# EAGLE design prius-gen2-v1.0 (EAGLE 6.4)
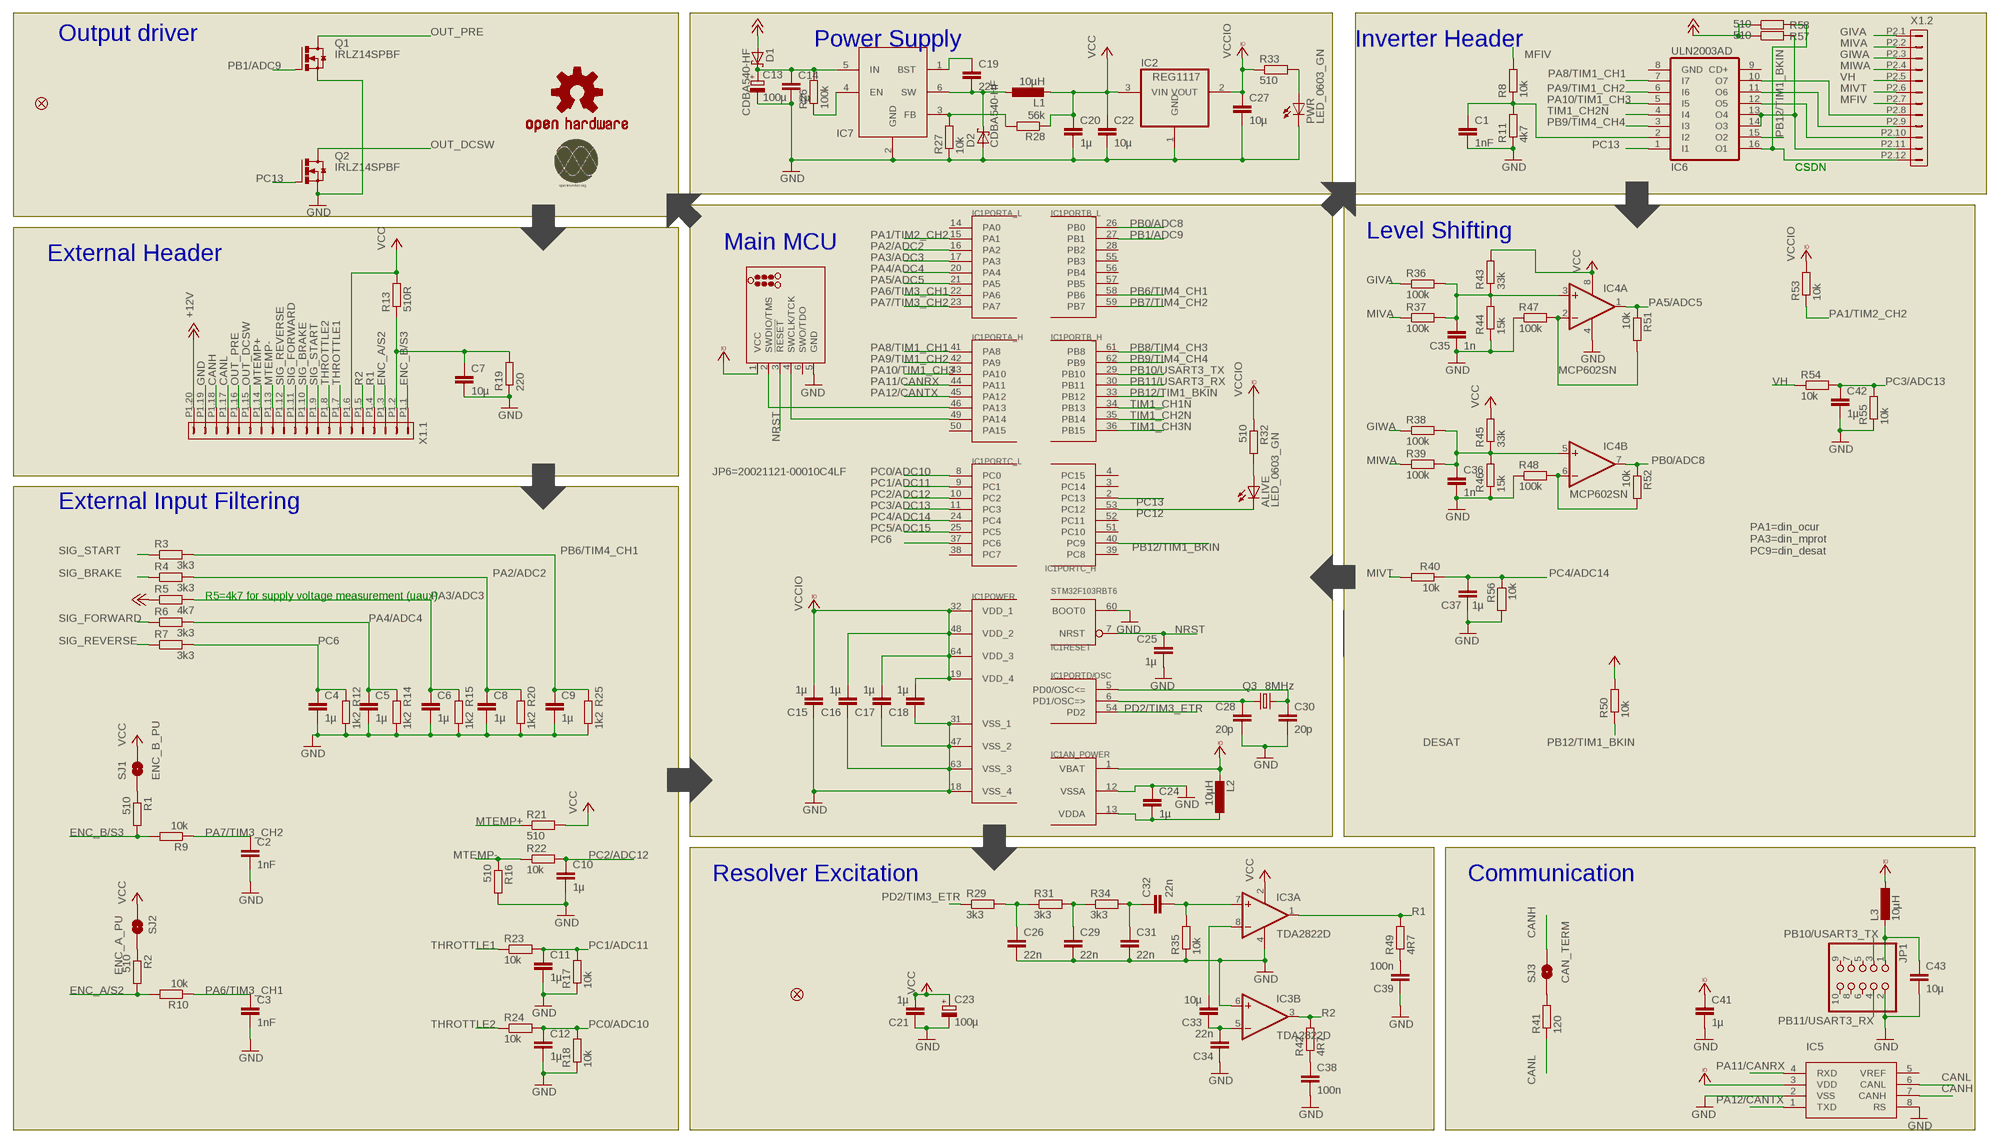
[diagram p0: schematic, sheet 1]

## Parts
ALIVE  LED_0603_GN  LEDSML0805  [SML0805]
C1  1nF  C-EUC0603  [C0603]
C2  1nF  C-EUC0603  [C0603]
C3  1nF  C-EUC0603  [C0603]
C4  1µ  C-EUC0603  [C0603]
C5  1µ  C-EUC0603  [C0603]
C6  1µ  C-EUC0603  [C0603]
C7  10µ  C-EUC0805  [C0805]
C8  1µ  C-EUC0603  [C0603]
C9  1µ  C-EUC0603  [C0603]
C10  1µ  C-EUC0603  [C0603]
C11  1µ  C-EUC0603  [C0603]
C12  1µ  C-EUC0603  [C0603]
C13  100µ  CPOL-EUUD-6,3X7,7  [UD-6,3X7,7_NICHICON]
C14  1µ  C-EUC0603  [C0603]
C15  1µ  C-EUC0603  [C0603]
C16  1µ  C-EUC0603  [C0603]
C17  1µ  C-EUC0603  [C0603]
C18  1µ  C-EUC0603  [C0603]
C19  22n  C-EUC0603  [C0603]
C20  1µ  C-EUC0603  [C0603]
C21  1µ  C-EUC0603  [C0603]
C22  10µ  C-EUC0805  [C0805]
C23  100µ  CPOL-EUUD-6,3X7,7  [UD-6,3X7,7_NICHICON]
C24  1µ  C-EUC0603  [C0603]
C25  1µ  C-EUC0603  [C0603]
C26  22n  C-EUC0603  [C0603]
C27  10µ  C-EUC0805  [C0805]
C28  20p  C-EUC0603  [C0603]
C29  22n  C-EUC0603  [C0603]
C30  20p  C-EUC0603  [C0603]
C31  22n  C-EUC0603  [C0603]
C32  22n  C-EUC0603  [C0603]
C33  10µ  C-EUC0805  [C0805]
C34  22n  C-EUC0603  [C0603]
C35  1n  C-EUC0603  [C0603]
C36  1n  C-EUC0603  [C0603]
C37  1µ  C-EUC0603  [C0603]
C38  100n  C-EUC0603  [C0603]
C39  100n  C-EUC0603  [C0603]
C41  1µ  C-EUC0603  [C0603]
C42  1µ  C-EUC0603  [C0603]
C43  10µ  C-EUC0805  [C0805]
D1  CDBA540-HF  SCHOTTKY-DIODESMD  [SMB]
D2  CDBA540-HF  SCHOTTKY-DIODESMD  [SMB]
FID1  FIDUCIAL1X2.5  [FIDUCIAL-1X2.5]
FID2  FIDUCIAL1X2.5  [FIDUCIAL-1X2.5]
IC1  STM32F103RBT6  STM32F10XRXT6  [TQFP64]
IC2  REG1117  [SOT223]
IC3  TDA2822D  [SO08]
IC4  MCP602SN  [SO08]
IC5  SN65HVD230  MCP2551  [SO08]
IC6  ULN2003AD  [SO16]
IC7  MB2359DJ  [SOT23-6]
J1  TC2030_SWD-MCP  [TC2030-MCP]
JP1  PINHD-2X5/90  [2X05/90]
L1  10µH  L-EUL2825P  [L2825P]
L2  10µH  L-EUL2012C  [L2012C]
L3  10µH  L-EUL2012C  [L2012C]
LOGO1  OSHW-LOGOM  [OSHW-LOGO-M]
PWR  LED_0603_GN  LEDSML0805  [SML0805]
Q1  IRLZ14SPBF  AP9T18GH-HF  [D-PAK_TO252AA]
Q2  IRLZ14SPBF  AP9T18GH-HF  [D-PAK_TO252AA]
Q3  8MHz  CRYSTALTXC-7A  [CRYSTAL-TXC-7A]
R1  510  R-EU_R0603  [R0603]
R2  510  R-EU_R0603  [R0603]
R3  3k3  R-EU_R0603  [R0603]
R4  3k3  R-EU_R0603  [R0603]
R5  4k7  R-EU_R0603  [R0603]
R6  3k3  R-EU_R0603  [R0603]
R7  3k3  R-EU_R0603  [R0603]
R8  10k  R-EU_R0603  [R0603]
R9  10k  R-EU_R0603  [R0603]
R10  10k  R-EU_R0603  [R0603]
R11  4k7  R-EU_R0603  [R0603]
R12  1k2  R-EU_R0603  [R0603]
R13  510R  R-EU_R0603  [R0603]
R14  1k2  R-EU_R0603  [R0603]
R15  1k2  R-EU_R0603  [R0603]
R16  510  R-EU_R0603  [R0603]
R17  10k  R-EU_R0603  [R0603]
R18  10k  R-EU_R0603  [R0603]
R19  220  R-EU_R0603  [R0603]
R20  1k2  R-EU_R0603  [R0603]
R21  510  R-EU_R0603  [R0603]
R22  10k  R-EU_R0603  [R0603]
R23  10k  R-EU_R0603  [R0603]
R24  10k  R-EU_R0603  [R0603]
R25  1k2  R-EU_R0603  [R0603]
R26  100k  R-EU_R0603  [R0603]
R27  10k  R-EU_R0603  [R0603]
R28  56k  R-EU_R0603  [R0603]
R29  3k3  R-EU_R0603  [R0603]
R31  3k3  R-EU_R0603  [R0603]
R32  510  R-EU_R0603  [R0603]
R33  510  R-EU_R0603  [R0603]
R34  3k3  R-EU_R0603  [R0603]
R35  10k  R-EU_R0603  [R0603]
R36  100k  R-EU_R0603  [R0603]
R37  100k  R-EU_R0603  [R0603]
R38  100k  R-EU_R0603  [R0603]
R39  100k  R-EU_R0603  [R0603]
R40  10k  R-EU_R0603  [R0603]
R41  120  R-EU_R0603  [R0603]
R42  4R7  R-EU_R0603  [R0603]
R43  33k  R-EU_R0603  [R0603]
R44  15k  R-EU_R0603  [R0603]
R45  33k  R-EU_R0603  [R0603]
R46  15k  R-EU_R0603  [R0603]
R47  100k  R-EU_R0603  [R0603]
R48  100k  R-EU_R0603  [R0603]
R49  4R7  R-EU_R0603  [R0603]
R50  10k  R-EU_R0603  [R0603]
R51  10k  R-EU_R0603  [R0603]
R52  10k  R-EU_R0603  [R0603]
R53  10k  R-EU_R0603  [R0603]
R54  10k  R-EU_R0603  [R0603]
R55  10k  R-EU_R0603  [R0603]
R56  10k  R-EU_R0603  [R0603]
R57  510  R-EU_R0603  [R0603]
R58  510  R-EU_R0603  [R0603]
SJ1  ENC_B_PU  SOLDERJUMPERNO  [SJ_2S-NO]
SJ2  ENC_A_PU  SOLDERJUMPERNO  [SJ_2S-NO]
SJ3  CAN_TERM  SOLDERJUMPERNO  [SJ_2S-NO]
U$1  OI-LOGO  [OI_LOGO]
X1  5810132011  [5810132011]

## Nets
+12V: D1.A R5.1 R57.1 R58.1 X1.P1.20
CANH: IC5.7(CANH) SJ3.2 X1.P1.18
CANL: IC5.6(CANL) R41.1 X1.P1.17
ENC_A/S2: R2.2 R10.2 X1.P1.3
ENC_B/S3: R1.2 R9.2 X1.P1.1
GIVA: R36.1 X1.P2.1
GIWA: R38.1 X1.P2.3
GND: C1.2 C2.2 C3.2 C4.2 C5.2 C6.2 C7.2 C8.2 C9.2 C10.2 C11.2 C12.2 C13.- C14.2 C15.1 C16.1 C17.1 C18.1 C20.2 C21.1 C22.2 C23.- C24.1 C25.2 C26.2 C27.2 C28.2 C29.2 C30.2 C31.2 C34.1 C35.2 C36.2 C37.2 C38.2 C39.1 C41.2 C42.2 C43.2 D2.A IC1.12(AN_POWER:VSSA) IC1.18(POWER:VSS_4) IC1.31(POWER:VSS_1) IC1.47(POWER:VSS_2) IC1.60(RESET:BOOT0) IC1.63(POWER:VSS_3) IC2.1(GND) IC3.4(P:V-) IC3.6(B:+IN) IC4.4(P:V-) IC5.2(VSS) IC5.8(RS) IC7.2(GND) J1.5(GND) JP1.2 PWR.C Q1.3(S) Q2.3(S) R11.1 R12.1 R14.1 R15.1 R16.2 R17.1 R18.1 R19.1 R20.1 R25.1 R27.1 R35.1 R44.1 R46.1 R47.1 R48.1 R55.1 R56.2 X1.P1.19
MFIV: R8.2 X1.P2.7
MIVA: R37.1 X1.P2.2
MIVT: R40.2 X1.P2.6
MIWA: R39.1 X1.P2.4
MTEMP+: R21.1 X1.P1.14
MTEMP-: R16.1 R22.1 X1.P1.13
N$1: IC6.12(O5) X1.P2.10
N$2: C28.1 IC1.6(PORTD/OSC:PD1/OSC=>) Q3.P$1
N$3: C13.+ C14.1 D1.C IC7.5(IN) R26.2
N$4: C30.1 IC1.5(PORTD/OSC:PD0/OSC<=) Q3.P$2
N$5: C19.1 IC7.1(BST)
N$6: IC1.46(PORTA_H:PA13) J1.2(SWDIO/TMS)
N$7: C24.2 IC1.13(AN_POWER:VDDA) L2.1
N$8: IC7.4(EN) R26.1
N$9: IC1.49(PORTA_H:PA14) J1.4(SWCLK/TCK)
N$10: C33.1 C34.2 IC3.5(B:-IN)
N$11: C39.2 R49.1
N$12: C33.2 IC3.8(A:-IN)
N$13: IC7.3(FB) R27.2 R28.2
N$14: C19.2 D2.C IC7.6(SW) L1.1
N$15: IC6.11(O6) X1.P2.9
N$16: IC6.10(O7) X1.P2.8
N$17: C29.1 R31.2 R34.1
N$18: C31.1 C32.1 R34.2
N$19: C32.2 IC3.7(A:+IN) R35.2
N$20: R2.1 SJ2.2
N$21: R1.1 SJ1.1
N$22: PWR.A R33.2
N$23: ALIVE.A R32.2
N$24: C1.1 IC6.2(I2) R8.1 R11.2
N$25: IC6.16(O1) R58.2 X1.P2.12
N$26: R41.2 SJ3.1
N$27: C38.1 R42.1
N$28: C43.1 JP1.1 L3.2
N$29: IC6.13(O4) IC6.14(O3) R57.2 X1.P2.11
N$30: C26.1 R29.2 R31.1
N$33: C36.1 IC4.5(B:+IN) R38.2 R39.2 R45.1 R46.2
N$34: C35.1 IC4.3(A:+IN) R36.2 R37.2 R43.1 R44.2
N$36: IC4.2(A:-IN) R47.2 R51.2
N$37: IC4.6(B:-IN) R48.2 R52.2
NRST: C25.1 IC1.7(RESET:NRST) J1.3(!RESET)
OUT_DCSW: Q2.4(D) X1.P1.15
OUT_PRE: Q1.4(D) X1.P1.16
PA1/TIM2_CH2: IC1.15(PORTA_L:PA1) R53.1
PA2/ADC2: C8.1 IC1.16(PORTA_L:PA2) R4.2 R20.2
PA3/ADC3: C6.1 IC1.17(PORTA_L:PA3) R5.2 R15.2
PA4/ADC4: C5.1 IC1.20(PORTA_L:PA4) R6.2 R14.2
PA5/ADC5: IC1.21(PORTA_L:PA5) IC4.1(A:OUT) R51.1
PA6/TIM3_CH1: C3.1 IC1.22(PORTA_L:PA6) R10.1
PA7/TIM3_CH2: C2.1 IC1.23(PORTA_L:PA7) R9.1
PA8/TIM1_CH1: IC1.41(PORTA_H:PA8) IC6.7(I7)
PA9/TIM1_CH2: IC1.42(PORTA_H:PA9) IC6.6(I6)
PA10/TIM1_CH3: IC1.43(PORTA_H:PA10) IC6.5(I5)
PA11/CANRX: IC1.44(PORTA_H:PA11) IC5.4(RXD)
PA12/CANTX: IC1.45(PORTA_H:PA12) IC5.1(TXD)
PB0/ADC8: IC1.26(PORTB_L:PB0) IC4.7(B:OUT) R52.1
PB1/ADC9: IC1.27(PORTB_L:PB1) Q1.1(G)
PB6/TIM4_CH1: C9.1 IC1.58(PORTB_L:PB6) R3.2 R25.2
PB7/TIM4_CH2: IC1.59(PORTB_L:PB7)
PB8/TIM4_CH3: IC1.61(PORTB_H:PB8)
PB9/TIM4_CH4: IC1.62(PORTB_H:PB9) IC6.3(I3)
PB10/USART3_TX: IC1.29(PORTB_H:PB10) JP1.3
PB11/USART3_RX: IC1.30(PORTB_H:PB11) JP1.4
PB12/TIM1_BKIN: IC1.33(PORTB_H:PB12) IC1.40(PORTC_H:PC9) IC6.15(O2) R50.1
PC0/ADC10: C12.1 IC1.8(PORTC_L:PC0) R18.2 R24.2
PC1/ADC11: C11.1 IC1.9(PORTC_L:PC1) R17.2 R23.2
PC2/ADC12: C10.1 IC1.10(PORTC_L:PC2) R22.2
PC3/ADC13: C42.1 IC1.11(PORTC_L:PC3) R54.2 R55.2
PC4/ADC14: C37.1 IC1.24(PORTC_L:PC4) R40.1 R56.1
PC5/ADC15: IC1.25(PORTC_L:PC5)
PC6: C4.1 IC1.37(PORTC_L:PC6) R7.2 R12.2
PC12: ALIVE.C IC1.53(PORTC_H:PC12)
PC13: IC1.2(PORTC_H:PC13) IC6.1(I1) Q2.1(G)
PD2/TIM3_ETR: IC1.54(PORTD/OSC:PD2) R29.1
R1: IC3.1(A:OUT) R49.2 X1.P1.4
R2: IC3.3(B:OUT) R42.2 X1.P1.5
S4/S1: C7.1 R13.1 R19.2 X1.P1.2
SIG_BRAKE: R4.1 X1.P1.10
SIG_FORWARD: R6.1 X1.P1.11
SIG_REVERSE: R7.1 X1.P1.12
SIG_START: R3.1 X1.P1.9
THROTTLE1: R23.1 X1.P1.7
THROTTLE2: R24.1 X1.P1.8
TIM1_CH1N: IC1.34(PORTB_H:PB13)
TIM1_CH2N: IC1.35(PORTB_H:PB14) IC6.4(I4)
TIM1_CH3N: IC1.36(PORTB_H:PB15)
VCC: C20.1 C21.2 C22.1 C23.+ IC2.3(VIN) IC3.2(P:V+) IC4.8(P:V+) L1.2 R13.2 R21.2 R28.1 R43.2 R45.2 R50.2 SJ1.2 SJ2.1 X1.P1.6
VCCIO: C15.2 C16.2 C17.2 C18.2 C27.1 C41.1 IC1.1(AN_POWER:VBAT) IC1.19(POWER:VDD_4) IC1.32(POWER:VDD_1) IC1.48(POWER:VDD_2) IC1.64(POWER:VDD_3) IC2.2(VOUT) IC5.3(VDD) J1.1(VCC) L2.2 L3.1 R32.1 R33.1 R53.2
VH: R54.1 X1.P2.5
Unconnected: IC1.3(PORTC_H:PC14) IC1.4(PORTC_H:PC15) IC1.14(PORTA_L:PA0) IC1.28(PORTB_L:PB2) IC1.38(PORTC_L:PC7) IC1.39(PORTC_H:PC8) IC1.50(PORTA_H:PA15) IC1.51(PORTC_H:PC10) IC1.52(PORTC_H:PC11) IC1.55(PORTB_L:PB3) IC1.56(PORTB_L:PB4) IC1.57(PORTB_L:PB5) IC5.5(VREF) IC6.9(CD+) J1.6(SWO/TDO) JP1.5 JP1.6 JP1.7 JP1.8 JP1.9 JP1.10

## Notes on the sheet
- Output driver | Power Supply | Inverter Header
- IC7
- CSDN | CSDN
- Level Shifting
- Main MCU
- External Header
- JP6=20021121-00010C4LF
- External Input Filtering
- PA1=din_ocur
  PA3=din_mprot
  PC9=din_desat
- R5=4k7 for supply voltage measurement (uaux)
- DESAT
- Resolver Excitation | Communication
- IC5

## Power pins joined to a net without a drawn wire
GND: IC6.8(GND)

## Library data of the parts
ALIVE PWR = led:LED: LED OSRAM: - CHIPLED LG R971, LG N971, LY N971, LG Q971, LY Q971, LO R971, LY R971 LH N974, LH R974 LS Q976, LO Q976, LY Q976 LO Q996 - Hyper CHIPLED LW Q18S LB Q993, LB Q99A, LB R99A - SideLED LS A670, LO A670, LY A670, LG A670, LP A670 LB A673, LV A673, LT A673, LW A673 LH A674 LY A675 LS A676, LA A676, LO A676, LY A676, LW A676 LS A679, LY A679, LG A679 - Hyper Micro SIDELED® LS Y876, LA Y876, LO Y876, LY Y876 LT Y87S - SmartLED LW L88C, LW L88S LB L89C, LB L89S, LG L890 LS L89K, LO L89K, LY L89K LS L896, LA L896, LO L896, LY L896 - TOPLED LS T670, LO T670, LY T670, LG T670, LP T670 LSG T670, LSP T670, LSY T670, LOP T670, LYG T670 LG T671, LOG T671, LSG T671 LB T673, LV T673, LT T673, LW T673 LH T674 LS T676, LA T676, LO T676, LY T676, LB T676, LH T676, LSB T676, LW T676 LB T67C, LV T67C, LT T67C, LS T67K, LO T67K, LY T67K, LW E67C LS E67B, LA E67B, LO E67B, LY E67B, LB E67C, LV E67C, LT E67C LW T67C LS T679, LY T679, LG T679 LS T770, LO T770, LY T770, LG T770, LP T770 LB T773, LV T773, LT T773, LW T773 LH T774 LS E675, LA E675, LY E675, LS T675 LS T776, LA T776, LO T776, LY T776, LB T776 LHGB T686 LT T68C, LB T68C - Hyper Mini TOPLED® LB M676 - Mini TOPLED Santana® LG M470 LS M47K, LO M47K, LY M47K Source: http://www.osram.convergy.de LUXEON: - LUMILED® LXK2-PW12-R00, LXK2-PW12-S00, LXK2-PW14-U00, LXK2-PW14-V00 LXK2-PM12-R00, LXK2-PM12-S00, LXK2-PM14-U00 LXK2-PE12-Q00, LXK2-PE12-R00, LXK2-PE12-S00, LXK2-PE14-T00, LXK2-PE14-U00 LXK2-PB12-K00, LXK2-PB12-L00, LXK2-PB12-M00, LXK2-PB14-N00, LXK2-PB14-P00, LXK2-PB14-Q00 LXK2-PR12-L00, LXK2-PR12-M00, LXK2-PR14-Q00, LXK2-PR14-R00 LXK2-PD12-Q00, LXK2-PD12-R00, LXK2-PD12-S00 LXK2-PH12-R00, LXK2-PH12-S00 LXK2-PL12-P00, LXK2-PL12-Q00, LXK2-PL12-R00 Source: www.luxeon.com KINGBRIGHT: KA-3528ASYC Source: www.kingbright.com
C1-C12 C14-C22 C24-C39 C41-C43 = rcl:C-EU: CAPACITOR, European symbol
C13 C23 = rcl:CPOL-EU: POLARIZED CAPACITOR, European symbol
D1 D2 = diode:SCHOTTKY-DIODE: Schottky Diode
FID1 FID2 = SparkFun-Aesthetics:FIDUCIAL: Fiducial Alignment Points Various fiducial points for machine vision alignment.
IC1 = stm32:STM32F10XRXT6: STM32F101/103 64pin LQFP
IC2 = burr-brown:REG1117: 800mA and 1A Low Dropout (LDO) Positive Regulator 1.8V, 2.5V, 2.85V, 3.3V, 5V, and Adj; MPN: REG1117; OC_FARNELL: 1097566; OC_NEWARK: 14P6981
IC3 = st-microelectronics:TDA2822: OP AMP
IC4 = linear:MCP602: Single Op Amp 2.7V to 6.0V Single Supply CMOS Source: http://ww1.microchip.com/downloads/en/DeviceDoc/21314g.pdf
IC5 = SparkFun-DigitalIC:MCP2551: CAN transceiver
IC6 = uln-udn:ULN2003A: DRIVER ARRAY
IC7 = v-reg-micrel:MB2359
J1 = tag-connect:TC2030_SWD: ARM20-CTX 20-Pin to TC2030-IDC Adapter for Cortex 6-Pin (TC2030-IDC family) </catalog/6> Cortex SWD </catalog/9> Adapters </adaptors> <javascript:void(0);> The Tag-Connect ARM20-CTX adapter board allows our TC2030-IDC cables to be used for ARM SWD (Single Wire Debug) applications. Although intended for use with our patented TC2030-IDC (and TC2030-IDC-NL) Plug-of-Nails™ Cables, the adapter may be useful to people wishing to use 6-pin 0.1” ribbon headers on their PCB instead of the traditional 20-Pin header. Please note the TC2030-IDC <http://tag-connect.com/TC2030-IDC> or TC2030-IDC-NL <http://tag-connect.com/TC2030-IDC-NL> cable is purchased separately, the cables and Segger JLINK seen in the pictures are not included! Download the Datasheet here. <http://www.tag-connect.com/Materials/ARM20-CTX.pdf>
JP1 = pinhead:PINHD-2X5: PIN HEADER
L1-L3 = rcl:L-EU: INDUCTOR, European symbol
LOGO1 = SparkFun-Aesthetics:OSHW-LOGO: Open Source Hardware Logo This logo indicates the piece of hardware it is found on incorporates a OSHW license and/or adheres to the definition of open source hardware found here: http://freedomdefined.org/OSHW
Q1 Q2 = transistor-power:AP9T18GH-HF
Q3 = SparkFun-FreqCtrl:CRYSTAL: Various standard crystals. Proven footprints. Spark Fun Electronics SKU : COM-00534
R1-R29 R31-R58 = rcl:R-EU_: RESISTOR, European symbol
SJ1-SJ3 = SparkFun-Passives:SOLDERJUMPER: Solder Jumper Standard SMD solder jumper. Used to automate production. Two varients : Normally Open and Normally Closed are the same, but have different paste layers. NC will have a large amount of paste and should jumper during reflow.
U$1 = SparkFun-Aesthetics:OI-LOGO
X1 = con-cinch:5810132011: 1FPC CONNECTOR Source: con-hirose.lbr from Bob Starr <rtzaudio@mindspring.com>

## Board
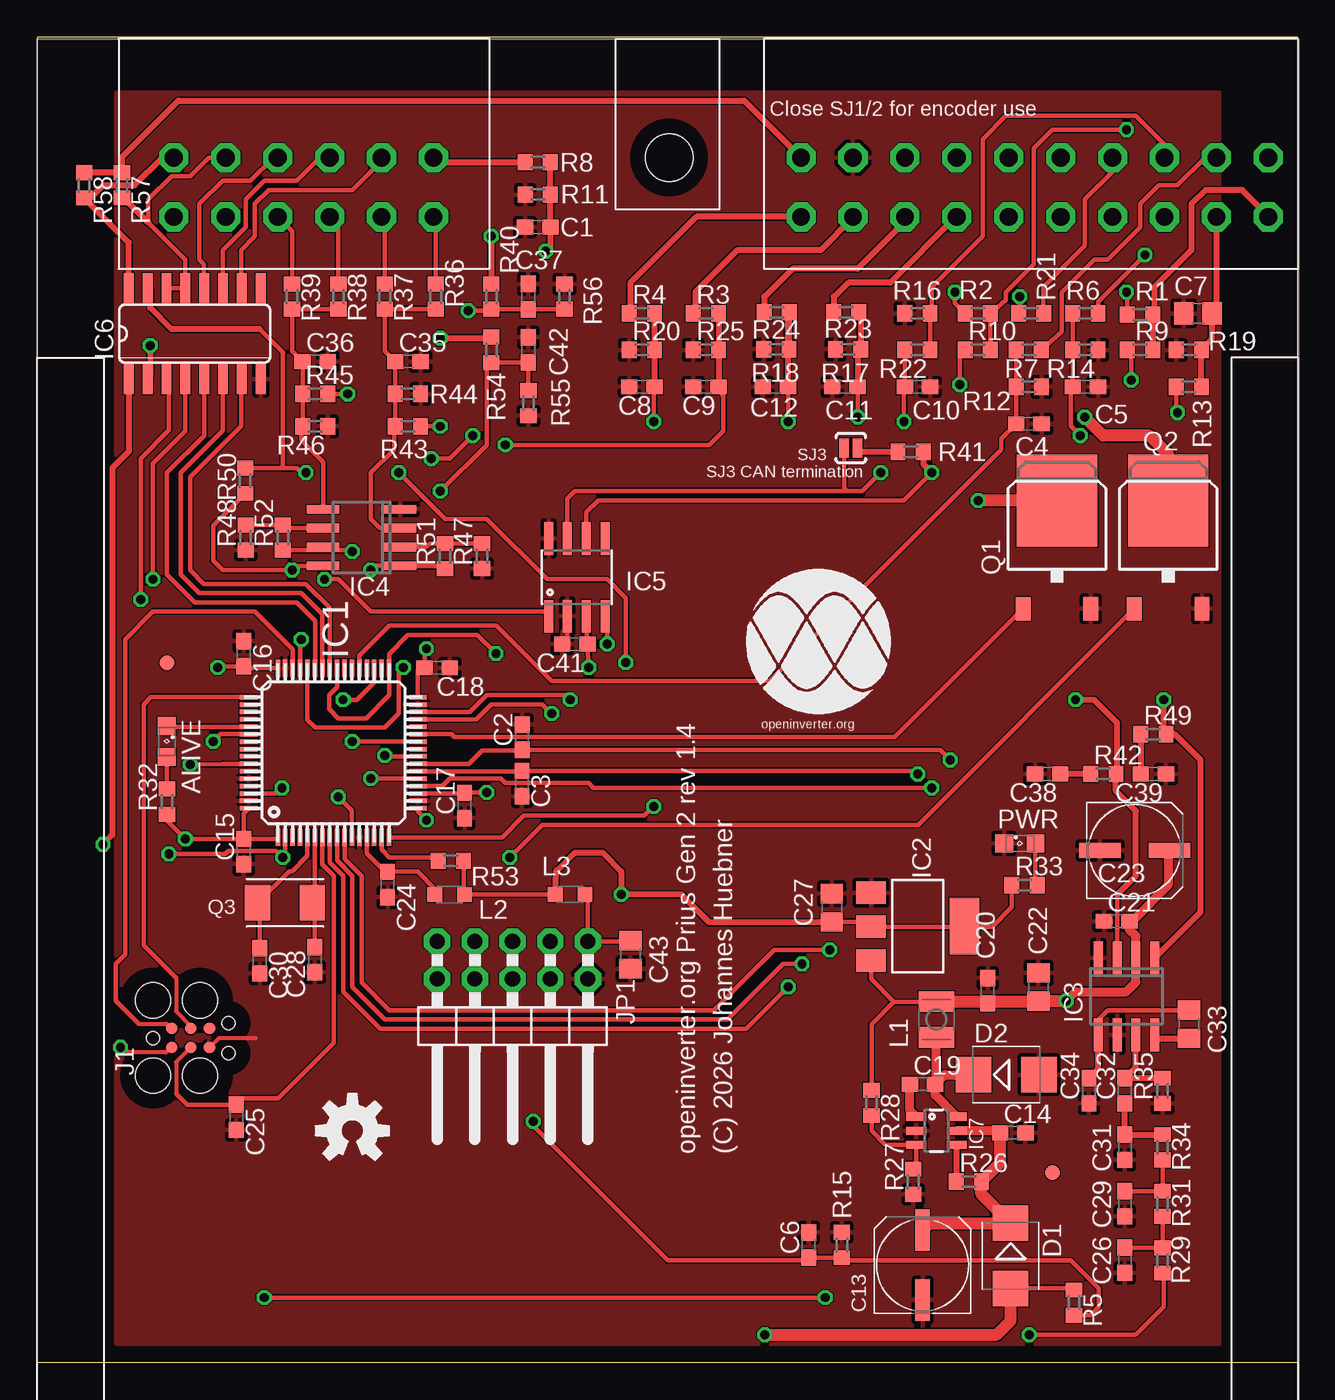
[diagram p1: board, top side]
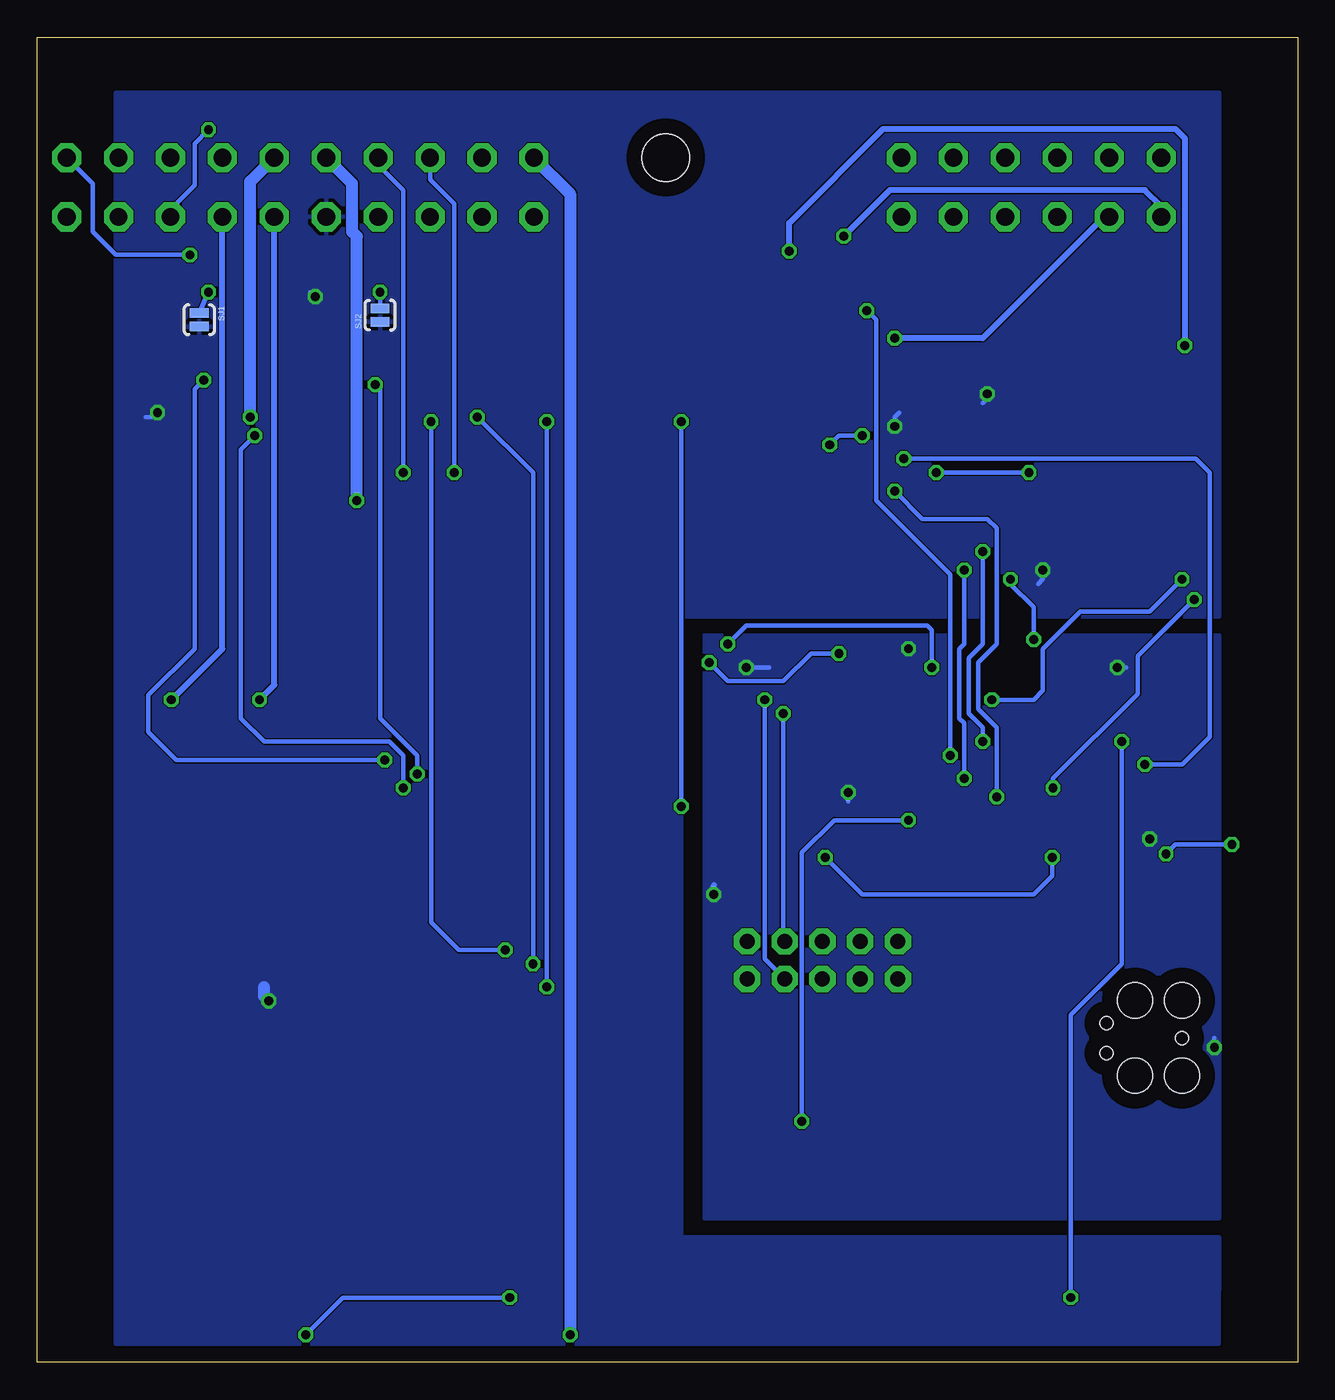
[diagram p2: board, bottom side, seen from below]

Size 84.99 x 89.38 mm. Coordinates in mm from the lower left corner, seen from the top.
Outline: 0,0 84.99,0 84.99,89.38 0,89.38 0,0
Copper layers (1*16): Top 0.035mm / dielectric 1.5mm / Bottom 0.035mm
Design rules "default *": minimum track width 10mil, minimum drill 0.5mm, track to track 3mil, track to pad 3mil, pad to pad 3mil, via to via 3mil, smd to smd 3mil, copper to edge 40mil, drill to drill 8mil, minimum pad ring 15mil, minimum via ring 8mil, stop-mask expansion 4mil, vias tented up to drill 0mil, thermal gap 10mil

### Footprints (pad centres in the part's own frame; a part is rotated, then mirrored left to right if it is on the bottom)
SML0805 = smd 1.2 x 1.2: A 1.05,0; C -1.05,0
C0603 = smd 1.1 x 1: 1 -0.85,0; 2 0.85,0
C0805 = smd 1.3 x 1.5: 1 -0.95,0; 2 0.95,0
UD-6,3X7,7_NICHICON = smd 2.8 x 1: + 2.35,0; - -2.35,0
SMB = smd 2.4 x 2.4: A 2.2,0; C -2.2,0
FIDUCIAL-1X2.5 = smd 1 x 1: 1 0,0
TQFP64 = smd 1.2 x 0.3: 1 -5.7,3.75; 2 -5.7,3.25; 3 -5.7,2.75; 4 -5.7,2.25; 5 -5.7,1.75; 6 -5.7,1.25; 7 -5.7,0.75; 8 -5.7,0.25; 9 -5.7,-0.25; 10 -5.7,-0.75; 11 -5.7,-1.25; 12 -5.7,-1.75; 13 -5.7,-2.25; 14 -5.7,-2.75; 15 -5.7,-3.25; 16 -5.7,-3.75; 33 5.7,-3.75; 34 5.7,-3.25; 35 5.7,-2.75; 36 5.7,-2.25; 37 5.7,-1.75; 38 5.7,-1.25; 39 5.7,-0.75; 40 5.7,-0.25; 41 5.7,0.25; 42 5.7,0.75; 43 5.7,1.25; 44 5.7,1.75; 45 5.7,2.25; 46 5.7,2.75; 47 5.7,3.25; 48 5.7,3.75 | smd 0.3 x 1.2: 17 -3.75,-5.7; 18 -3.25,-5.7; 19 -2.75,-5.7; 20 -2.25,-5.7; 21 -1.75,-5.7; 22 -1.25,-5.7; 23 -0.75,-5.7; 24 -0.25,-5.7; 25 0.25,-5.7; 26 0.75,-5.7; 27 1.25,-5.7; 28 1.75,-5.7; 29 2.25,-5.7; 30 2.75,-5.7; 31 3.25,-5.7; 32 3.75,-5.7; 49 3.75,5.7; 50 3.25,5.7; 51 2.75,5.7; 52 2.25,5.7; 53 1.75,5.7; 54 1.25,5.7; 55 0.75,5.7; 56 0.25,5.7; 57 -0.25,5.7; 58 -0.75,5.7; 59 -1.25,5.7; 60 -1.75,5.7; 61 -2.25,5.7; 62 -2.75,5.7; 63 -3.25,5.7; 64 -3.75,5.7
SOT223 = smd 1.499 x 2.007: 1 -2.261,-3.15; 2 0.025,-3.15; 3 2.311,-3.15 | smd 3.81 x 2.007: 4 0,3.15
SO08 = smd 0.6 x 2.2: 1 -1.905,-2.6; 2 -0.635,-2.6; 3 0.635,-2.6; 4 1.905,-2.6; 5 1.905,2.6; 6 0.635,2.6; 7 -0.635,2.6; 8 -1.905,2.6
SO08' = smd 0.61 x 2.21: 1 -1.905,-2.616; 2 -0.635,-2.616; 3 0.635,-2.616; 4 1.905,-2.616; 5 1.905,2.616; 6 0.635,2.616; 7 -0.635,2.616; 8 -1.905,2.616
SO16 = smd 0.66 x 2.032: 1 -4.445,-3.073; 2 -3.175,-3.073; 3 -1.905,-3.073; 4 -0.635,-3.073; 5 0.635,-3.073; 6 1.905,-3.073; 7 3.175,-3.073; 8 4.445,-3.073; 9 4.445,3.073; 10 3.175,3.073; 11 1.905,3.073; 12 0.635,3.073; 13 -0.635,3.073; 14 -1.905,3.073; 15 -3.175,3.073; 16 -4.445,3.073
SOT23-6 = smd 0.55 x 1.35: 1 -0.95,-1.375; 2 0,-1.375; 3 0.95,-1.375; 4 0.95,1.375; 5 0,1.375; 6 -0.95,1.375
TC2030-MCP = smd 0.787 x 0.787: 1 1.27,-0.635; 2 1.27,0.635; 3 2.54,-0.635; 4 2.54,0.635; 5 3.81,-0.635; 6 3.81,0.635 | hole 0.889: 0,0; 5.08,-1.016; 5.08,1.016 | hole 2.375: 0,2.54; 0,-2.54; 3.175,-2.54; 3.175,2.54
2X05/90 = drill 1.016 octagon: 1 -5.08,-6.35; 2 -5.08,-3.81; 3 -2.54,-6.35; 4 -2.54,-3.81; 5 0,-6.35; 6 0,-3.81; 7 2.54,-6.35; 8 2.54,-3.81; 9 5.08,-6.35; 10 5.08,-3.81
L2825P = smd 1.4 x 2.4: 1 -1.2,0; 2 1.2,0
L2012C = smd 1 x 1: 1 -1,0; 2 1,0
D-PAK_TO252AA = smd 1 x 1.6: 1 -2.28,-4.8; 3 2.28,-4.8 | smd 5.4 x 6.2: 4 0,2.5
CRYSTAL-TXC-7A = smd 1.7 x 2.4: P$1 1.85,0; P$2 -1.85,0
R0603 = smd 1 x 1.1: 1 -0.85,0; 2 0.85,0
SJ_2S-NO = smd 0.635 x 1.27: 1 -0.45,0; 2 0.45,0
5810132011 = drill 1.2 octagon: P1.1 -2,3.5; P1.2 -5.5,3.5; P1.3 -9,3.5; P1.4 -12.5,3.5; P1.5 -16,3.5; P1.6 -19.5,3.5; P1.7 -23,3.5; P1.8 -26.5,3.5; P1.9 -30,3.5; P1.10 -33.5,3.5; P1.11 -2,7.5; P1.12 -5.5,7.5; P1.13 -9,7.5; P1.14 -12.5,7.5; P1.15 -16,7.5; P1.16 -19.5,7.5; P1.17 -23,7.5; P1.18 -26.5,7.5; P1.19 -30,7.5; P1.20 -33.5,7.5; P2.1 -58.28,3.5; P2.2 -61.78,3.5; P2.3 -65.28,3.5; P2.4 -68.78,3.5; P2.5 -72.28,3.5; P2.6 -75.78,3.5; P2.7 -58.28,7.5; P2.8 -61.78,7.5; P2.9 -65.28,7.5; P2.10 -68.78,7.5; P2.11 -72.28,7.5; P2.12 -75.78,7.5 | hole 3.2: -42.39,7.5

### Placement (x,y rotation side)
ALIVE  8.75,41.88 270 top
C1  33.75,76.56 180 top
C2  32.7,42.16 90 top
C3  32.69,39.03 270 top
C4  66.86,63.29 0 top
C5  70.67,65.79 0 top
C6  52.02,7.92 90 top
C7  78.25,70.74 180 top
C8  40.77,65.79 180 top
C9  45.09,65.79 180 top
C10  59.35,65.79 0 top
C11  54.45,65.79 180 top
C12  49.77,65.79 180 top
C13  59.69,6.56 90 top
C14  65.77,15.48 0 top
C15  13.94,34.45 90 top
C16  13.93,47.79 270 top
C17  28.82,37.55 90 top
C18  26.97,46.84 180 top
C19  59.69,18.75 0 top
C20  64.08,25.07 90 top
C21  72.78,29.75 0 top
C22  67.5,25.31 90 top
C23  73.99,34.53 0 top
C24  23.62,32.23 90 top
C25  13.44,16.53 270 top
C26  73.33,6.89 270 top
C27  53.58,30.66 90 top
C28  18.72,27.16 270 top
C29  73.33,10.7 270 top
C30  15.01,27.09 270 top
C31  73.33,14.51 270 top
C32  73.33,18.32 90 top
C33  77.65,22.8 270 top
C34  70.91,18.32 90 top
C35  25,67.5 0 top
C36  18.75,67.5 0 top
C37  33.12,71.87 90 top
C38  68.12,39.69 180 top
C39  75.25,39.69 180 top
C41  36.25,48.44 180 top
C42  33.12,68.28 90 top
C43  40,27.5 270 top
D1  65.62,7.19 270 top
D2  65.33,19.4 0 top
FID1  68.44,12.81 0 top
FID2  8.75,47.19 0 top
IC1  19.98,41.12 90 top
IC2  59.37,29.41 270 top
IC3  73.44,24.69 180 top
IC4  21.88,55.62 90 top
IC5  SN65HVD230  [SO08']  36.39,52.93 0 top
IC6  10.62,69.38 0 top
IC7  60.62,15.62 270 top
J1  7.81,21.88 0 top
JP1  32.05,22.05 180 top
L1  60.62,23.12 90 top
L2  27.81,31.54 0 top
L3  35.94,31.56 0 top
LOGO1  21.25,15.62 0 top
PWR  66.25,35 0 top
Q1  68.75,55.62 0 top
Q2  76.25,55.62 0 top
Q3  16.71,31 0 top
R1  74.35,70.66 0 top
R2  63.41,70.74 0 top
R3  45.09,70.74 0 top
R4  40.77,70.74 0 top
R5  69.89,4.04 270 top
R6  70.67,70.74 180 top
R7  66.85,68.28 180 top
R8  33.75,80.94 180 top
R9  74.35,68.28 0 top
R10  63.41,68.28 0 top
R11  33.75,78.75 0 top
R12  66.86,65.79 180 top
R13  77.64,65.79 180 top
R14  70.67,68.28 180 top
R15  54.25,7.92 270 top
R16  59.35,70.74 180 top
R17  54.67,68.33 0 top
R18  49.84,68.33 0 top
R19  77.64,68.28 0 top
R20  40.77,68.28 0 top
R21  67.02,70.74 180 top
R22  59.35,68.28 180 top
R23  54.55,70.82 0 top
R24  49.86,70.82 0 top
R25  45.09,68.28 0 top
R26  62.81,12.19 0 top
R27  59.06,12.19 90 top
R28  56.25,17.5 270 top
R29  75.86,6.88 90 top
R31  75.86,10.7 90 top
R32  8.75,37.81 90 top
R33  66.56,32.19 0 top
R34  75.86,14.51 90 top
R35  75.86,18.32 90 top
R36  26.88,71.87 270 top
R37  23.44,71.87 270 top
R38  20.31,71.87 270 top
R39  17.19,71.87 270 top
R40  30.62,71.87 90 top
R41  58.89,61.4 180 top
R42  71.88,39.69 0 top
R43  25,63.12 0 top
R44  25,65.31 180 top
R45  18.75,65.31 0 top
R46  18.75,63.12 180 top
R47  30,54.38 90 top
R48  14.06,55.62 90 top
R49  75.25,42.36 0 top
R50  14.03,59.45 270 top
R51  27.5,54.38 90 top
R52  16.56,55.62 90 top
R53  27.89,33.82 0 top
R54  30.62,68.28 270 top
R55  33.12,64.69 90 top
R56  35.56,71.87 90 top
R57  5.71,79.38 270 top
R58  3.17,79.38 270 top
SJ1  74.06,70.31 270 bottom
SJ2  61.88,70.62 90 bottom
SJ3  54.85,61.66 180 top
U$1  47.81,43.75 0 top
X1  85,73.75 0 top

### Tracks (layer width: path | path; a pad name or v marks a point on that pad's centre or on a via)
+12V  (via drill 0.6)
  Top 0.305: R5.1 69.79,4.99 D1.A
  Top 0.406: X1.P1.20 47.66,85.09 9.53,85.09 5.71,81.28 R57.1 R58.1
  Top 0.813: v49.06,1.88 64.69,1.88 65.62,2.81 D1.A
  Bottom 0.813: X1.P1.20 49.06,78.81 v49.06,1.88
CANH  (via drill 0.6)
  Top 0.305: v56.88,60 55.62,58.75 54.61,58.75 | 54.61,58.75 36.25,58.75 35.75,58.25 IC5.7 | SJ3.2 54.4,58.96 54.61,58.75
  Bottom 0.305: X1.P1.18 58.5,79.75 56.88,78.12 v56.88,60
CANL  (via drill 0.6)
  Top 0.305: v60.31,60 58.44,58.12 37.81,58.12 37.02,57.34 IC5.6
  Top 0.406: R41.1 59.74,60.57 v60.31,60
  Bottom 0.305: X1.P1.17 62,80.75 60.31,79.06 v60.31,60
ENC_A/S2  (via drill 0.6)
  Top 0.305: R10.2 R2.2 65.31,71.63 65.31,72.19 67.19,74.06 67.19,81.88 68.44,83.12 v73.44,83.12
  Bottom 0.305: v73.44,83.12 74.38,82.19 74.38,79.38 76,77.75 X1.P1.3
ENC_B/S3
  Top 0.406: X1.P1.1 83,77.31 81.25,79.06 78.75,79.06 77.81,78.12 77.81,75 75.31,72.5 75.31,70.77 R1.2 R9.2
GIVA
  Top 0.305: R36.1 26.88,77.09 X1.P2.1
GIWA
  Top 0.305: R38.1 20.31,76.66 X1.P2.3
GND
  Top 0.254: J1.5 12.27,21.89 14.73,21.89
  Top 0.305: J1.5 11.55,21.24 | C41.2 35.75,48.79 IC5.2
  pour Top: 5.33,85.61 79.68,85.61 79.68,1.27 5.33,1.27
MFIV
  Top 0.406: X1.P2.7 27.03,80.94 R8.2
MIVA
  Top 0.305: R37.1 23.44,77.03 X1.P2.2
MIVT  (via drill 0.6)
  Top 0.406: v30.62,75.94 R40.2
  Bottom 0.406: X1.P2.6 9.22,77.97 10.31,79.06 27.5,79.06 v30.62,75.94
MIWA
  Top 0.305: R39.1 17.19,76.28 X1.P2.4
MTEMP+
  Top 0.305: X1.P1.14 72.5,80.31 70.62,78.44 70.62,75.31 67.81,72.5 67.81,70.77 R21.1
MTEMP-
  Top 0.305: R22.1 R16.1 60.31,70.86 60.31,72.5 63.75,75.94 63.75,82.5 65.31,84.06 74.06,84.06 76,82.12 X1.P1.13
N$1
  Top 0.305: X1.P2.10 15.94,81.25 14.38,79.69 12.5,79.69 10.94,78.12 10.94,74.38 11.25,74.06 IC6.12
N$2
  Top 0.305: IC1.6 18.73,31.17 Q3.P$1 18.72,30.84 C28.1
N$3
  Top 0.61: C14.1 64.78,15.62 IC7.5
  Top 0.813: C13.+ 60.16,9.39 D1.C 63.66,11.35 R26.2 64.92,13.45 C14.1
N$4
  Top 0.305: IC1.5 18.23,34.16 17.19,33.12 16.98,33.12 Q3.P$2 15.01,30.85 C30.1
N$5
  Top 0.61: IC7.1 58.84,16.99 C19.1
N$6
  Top 0.254: 6.86,22.84 8.71,22.84
  Top 0.305: IC1.46 17.23,48.09 14.69,50.62 7.81,50.62 5.94,48.75 5.94,27.5 5.31,26.88 5.31,24.38 6.67,23 6.86,22.84 | 9.06,22.53 J1.2 8.71,22.84
N$7
  Top 0.305: IC1.13 22.23,34.34 23.48,33.08 C24.2 23.65,33.1 25.64,33.1 26.88,31.88 L2.1
N$8
  Top 0.406: R26.1 62,12.19 IC7.4
N$9
  Top 0.254: 9.38,25.94 9.38,23.69 10.35,22.68
  Top 0.305: IC1.49 7.68,44.87 7.19,44.38 7.19,28.12 9.38,25.94 | 10.31,22.55 J1.4 10.35,22.68
N$10
  Top 0.305: C33.1 72.19,23.75 71.53,23.09 IC3.5
  Top 0.406: C34.2 71.53,19.8 IC3.5
N$11
  Top 0.406: R49.1 C39.2
N$12
  Top 0.406: IC3.8 75.58,21.85 C33.2
N$13
  Top 0.305: R27.2 59.25,13.22 IC7.3 59.24,14.69 57.19,14.69 56.25,15.62 R28.2
N$14
  Top 0.61: IC7.6 60.54,18.04 C19.2 | C19.2 61.19,19.4 D2.C | C19.2 60.62,18.84 L1.1
N$15
  Top 0.305: X1.P2.9 19.06,81.25 17.5,79.69 15.31,79.69 14.06,78.44 14.06,76.56 12.5,75 12.5,72.48 IC6.11
N$16
  Top 0.305: X1.P2.8 23.22,81.03 21.25,79.06 15.62,79.06 14.69,78.12 14.69,75.94 13.75,75 13.75,72.5 IC6.10
N$17
  Top 0.305: C29.1 R31.2 R34.1
N$18
  Top 0.406: C32.1 C31.1 R34.2
N$19
  Top 0.406: R35.2 C32.2 74.07,19.92 IC3.7
N$20  (via drill 0.6)
  Top 0.305: v61.88,72.19 61.88,71.42 R2.1
  Bottom 0.305: SJ2.2 v61.88,72.19
N$21  (via drill 0.6)
  Top 0.305: R1.1 73.5,72.13 v73.44,72.19
  Bottom 0.305: v73.44,72.19 SJ1.1
N$22
  Top 0.305: R33.2 67.3,32.3 PWR.A
N$23
  Top 0.305: ALIVE.A R32.2
N$24  (via drill 0.6)
  Top 0.406: R8.1 R11.2 C1.1 34.6,75.24 v34.29,74.93 | v7.62,68.58 7.62,66.47 IC6.2
  Bottom 0.406: v34.29,74.93 34.29,76.83 27.94,83.19 8.26,83.19 7.62,82.55 v7.62,68.58
N$25
  Top 0.406: X1.P2.12 8.44,81.25 6.57,79.38 4.45,79.38 3.6,78.53 R58.2 6.18,75.52 IC6.16
N$26
  Top 0.406: R41.2 55.56,61.4 SJ3.1
N$27
  Top 0.406: R42.1 C38.1
N$28
  Top 0.305: C43.1 39.95,28.39 JP1.1 37.13,31.68 L3.2
N$29
  Top 0.305: X1.P2.11 11.56,81.25 10.31,80 9.06,80 7.5,78.44 7.5,76.88 10,74.38 IC6.13 IC6.14
  Top 0.406: R57.2 5.85,78.53 7.5,76.88
N$30
  Top 0.305: C26.1 73.34,7.72 R29.2 R31.1
N$33
  Top 0.305: R38.2 R39.2 17.19,68.21 C36.1 R45.1 R46.2 17.81,63.04 17.81,62.19 19.27,60.73 IC4.5
N$34
  Top 0.305: R36.2 R37.2 23.44,68.21 C35.1 R44.2 R43.1 24.06,63.04 24.06,61.56 22.5,60 22.5,56.88 23.11,56.26 IC4.3
N$36
  Top 0.305: IC4.2 26.25,55 26.48,55.23 R51.2 R47.2
N$37
  Top 0.305: IC4.6 16.78,56.26 R52.2 R48.2
NRST
  Top 0.254: J1.3 9.38,20.26 9.38,18.12
  Top 0.305: IC1.7 19.23,33.59 20,32.81 20,21.56 16.25,17.81 13.75,17.81 13.75,17.7 C25.1 10.12,17.38 9.38,18.12
OUT_DCSW  (via drill 0.6)
  Top 0.813: Q2.4 76.25,61.25 75,62.5 71.88,62.5 v70.62,63.75
  Bottom 0.813: v70.62,63.75 70.62,79.62 X1.P1.15
OUT_PRE  (via drill 0.6)
  Top 0.813: Q1.4 v63.44,58.12
  Bottom 0.813: v63.44,58.12 63.44,75.94 63.75,76.25 63.75,79.5 X1.P1.16
PA1/TIM2_CH2
  Top 0.305: R53.1 26.8,34.06 23.75,34.06 23.23,34.59 IC1.15
PA2/ADC2  (via drill 0.6)
  Top 0.305: C8.1 41.56,65.4 v41.56,63.44 | v41.56,37.5 40.94,36.88 32.81,36.88 31.35,35.41 IC1.16
  Top 0.406: C8.1 R20.2 R4.2
  Bottom 0.305: v41.56,63.44 v41.56,37.5
PA3/ADC3  (via drill 0.6)
  Top 0.305: R5.2 71,3.19 71.56,3.75 71.56,5 69.69,6.88 54.44,6.88 R15.2 C6.1 51.83,6.88 42.5,6.88 33.44,15.94 v33.44,16.25 | v26.25,36.56 25.68,37.14 IC1.17
  Bottom 0.305: v33.44,16.25 33.44,34.38 31.25,36.56 v26.25,36.56
PA4/ADC4  (via drill 0.6)
  Top 0.305: R6.2 R14.2 C5.1 69.69,65.66 69.69,63.12 v70.31,62.5 | v60.31,38.75 37.5,38.75 37.19,39.06 31.56,39.06 31.25,39.38 27.81,39.38 27.3,38.87 IC1.20
  Bottom 0.305: v70.31,62.5 71.25,61.56 71.25,43.44 69.69,41.88 61.25,41.88 60.31,40.94 v60.31,38.75
PA5/ADC5  (via drill 0.6)
  Top 0.305: R51.1 27.3,53.72 IC4.1 24.45,53.75 22.81,53.75 v22.5,53.44 | IC1.21 22.51,39.37 v22.5,39.38
  Bottom 0.305: v22.5,39.38 22.5,43.12 22.81,43.44 22.81,48.12 22.5,48.44 v22.5,53.44
PA6/TIM3_CH1  (via drill 0.6)
  Top 0.305: IC1.22 32.67,39.87 C3.1 59.26,39.88 v59.38,39.69 | R10.1 62.19,67.75 v62.19,65.94
  Bottom 0.305: v62.19,65.94 61.88,65.62 61.88,43.44 59.38,40.94 v59.38,39.69
PA7/TIM3_CH2  (via drill 0.6)
  Top 0.305: IC1.23 29.11,40.37 30,41.25 32.64,41.25 C2.1 60.88,41.31 v61.56,40.62 | R9.1 73.75,67.94 v73.75,66.25
  Bottom 0.305: v73.75,66.25 74.38,65.62 74.38,48.12 77.5,45 77.5,42.5 75.62,40.62 v61.56,40.62
PA8/TIM1_CH1
  Top 0.305: IC1.41 19.73,50.9 18.12,52.5 11.25,52.5 10.31,53.44 10.31,59.69 13.75,63.12 13.75,66.25 IC6.7
PA9/TIM1_CH2
  Top 0.305: IC6.6 12.53,62.84 9.69,60 9.69,53.12 10.94,51.88 17.81,51.88 19.23,50.46 IC1.42
PA10/TIM1_CH3
  Top 0.305: IC6.5 11.26,62.51 8.75,60 8.75,53.12 10.62,51.25 17.5,51.25 18.75,50 18.75,46.84 IC1.43
PA11/CANRX  (via drill 0.6)
  Top 0.305: IC5.4 38.44,50.17 v38.44,48.44 | v24.69,46.88 24.38,46.56 24.38,43.75 23.44,42.81 18.75,42.81 18.23,43.34 IC1.44
  Bottom 0.305: v38.44,48.44 37.19,49.69 25,49.69 24.69,49.38 v24.69,46.88
PA12/CANTX  (via drill 0.6)
  Top 0.305: IC5.1 34.17,50.62 22.5,50.62 20.31,52.81 v19.38,52.81 | v17.81,48.75 17.73,48.66 IC1.45
  Bottom 0.305: v17.81,48.75 17.81,50.94 19.38,52.5 v19.38,52.81
PB0/ADC8  (via drill 0.6)
  Top 0.305: R52.1 19.06,54.77 | 19.06,54.77 IC4.7 | 19.06,54.77 21.16,54.77 v21.25,54.69 | v21.25,41.88 25.66,41.88 IC1.26
  Bottom 0.305: v21.25,54.69 21.25,48.44 22.19,47.5 22.19,43.75 21.25,42.81 v21.25,41.88
PB1/ADC9
  Top 0.305: Q1.1 57.83,42.19 28.12,42.19 27.95,42.37 IC1.27
PB6/TIM4_CH1  (via drill 0.6)
  Top 0.305: C9.1 46.25,65.14 46.25,62.81 45.31,61.88 v31.56,61.88 | v29.38,62.5 27.81,60.94 v26.56,60.94 | v10.31,40.31 12.55,40.37 IC1.58
  Top 0.406: R3.2 R25.2 C9.1
  Bottom 0.305: v31.56,61.88 30.94,62.5 v29.38,62.5 | v26.56,60.94 6.88,60.94 5.94,60 5.94,42.19 7.81,40.31 v10.31,40.31
PB9/TIM4_CH4  (via drill 0.6)
  Top 0.305: IC6.3 8.89,66.13 8.89,62.87 6.99,60.96 v6.99,51.44 | v16.51,38.73 16.14,38.37 IC1.62
  Bottom 0.305: v6.99,51.44 10.79,47.62 10.79,45.09 16.51,39.37 v16.51,38.73
PB10/USART3_TX  (via drill 0.6)
  Top 0.305: v34.69,43.75 34.06,44.38 30.62,44.38 29.61,43.37 IC1.29
  Bottom 0.305: JP1.3 34.69,28.49 v34.69,43.75
PB11/USART3_RX  (via drill 0.6)
  Top 0.305: v35.94,44.69 35.62,45 30.31,45 29.18,43.87 IC1.30
  Bottom 0.305: JP1.4 35.94,27.2 v35.94,44.69
PB12/TIM1_BKIN  (via drill 0.6)
  Top 0.305: 15,69.69 16.59,68.09 16.57,68.06 16.57,60.31 | R50.1 16.56,60.3 16.57,60.31 | 16.57,60.31 17.5,60.31 17.81,60 v18.12,60 | v24.38,60 27.5,56.88 30.31,56.88 34.38,52.81 38.44,52.81 39.69,51.56 v39.69,47.19 | v30.94,47.81 29.69,49.06 25,49.06 23.73,47.79 IC1.33 23.75,46.79 23.75,45 22.19,43.44 20.31,43.44 19.69,44.06 19.69,45 20.23,45.54 IC1.40
  Top 0.406: 15,69.69 9.05,69.69 7.62,71.12 7.62,72.28 IC6.15
  Bottom 0.305: v18.12,60 v24.38,60 | v39.69,47.19 38.44,45.94 34.69,45.94 32.81,47.81 v30.94,47.81
PC0/ADC10  (via drill 0.6)
  Top 0.305: C12.1 50.62,65.39 v50.62,63.44 | v50.62,25.31 47.81,22.5 23.12,22.5 20.62,25 20.62,32.81 19.73,33.71 IC1.8
  Top 0.406: 50.71,65.49 C12.1 50.62,70.82 R24.2 50.69,70.82 R18.2
  Bottom 0.305: v50.62,63.44 v50.62,25.31
PC1/ADC11  (via drill 0.6)
  Top 0.305: C11.1 55.31,65.62 v55.31,63.75 | v51.56,26.88 50.31,26.88 46.56,23.12 23.44,23.12 21.25,25.31 21.25,32.81 20.23,33.84 IC1.9
  Top 0.406: R23.2 55.52,70.82 R17.2 55.3,68.33 C11.1
  Bottom 0.305: v55.31,63.75 51.56,60 v51.56,26.88
PC2/ADC12  (via drill 0.6)
  Top 0.305: R22.2 C10.1 58.44,65.39 v58.44,63.44 | v53.44,27.81 49.69,27.81 45.62,23.75 23.75,23.75 21.88,25.62 21.88,32.81 20.73,33.96 IC1.10
  Bottom 0.305: v58.44,63.44 58.44,29.69 56.56,27.81 v53.44,27.81
PC3/ADC13  (via drill 0.6)
  Top 0.305: v20.31,38.12 21.23,37.21 IC1.11 | v27.19,58.75 30.31,61.88 30.31,67.29 R54.2 C42.1 33.12,67.33 R55.2
  Bottom 0.305: v20.31,38.12 20.31,42.81 21.56,44.06 21.56,47.19 20.31,48.44 20.31,56.25 20.94,56.88 25.31,56.88 v27.19,58.75
PC4/ADC14  (via drill 0.6)
  Top 0.305: v29.06,70.94 30.54,70.94 R40.1 C37.1 R56.1 | v23.44,40.94 23.51,40.87 IC1.24
  Bottom 0.305: v29.06,70.94 28.44,70.31 28.44,58.12 23.44,53.12 v23.44,40.94
PC6
  Top 0.305: R7.2 66,65.77 R12.2 C4.1 65,62.28 65,61.56 49.38,45.94 34.69,45.94 30.94,49.69 23.75,49.69 21.73,47.66 IC1.37
PC12
  Top 0.305: IC1.53 9.12,42.87 ALIVE.C
PC13  (via drill 0.6)
  Top 0.305: Q2.1 59.4,36.25 34.06,36.25 v31.88,34.06 | IC1.2 16.73,34.23 v16.56,34.06 16.12,34.5 12.9,34.5 12.69,34.29 v8.89,34.29
  Top 0.406: IC6.1 6.18,61.42 5.08,60.33 5.08,35.56 v4.45,34.92
  Bottom 0.305: v31.88,34.06 29.38,31.56 17.81,31.56 16.56,32.81 v16.56,34.06 | v4.45,34.92 8.26,34.92 v8.89,34.29
PD2/TIM3_ETR  (via drill 0.6)
  Top 0.305: R29.1 75.94,5.95 75.94,3.75 74.06,1.88 v66.88,1.88 | v53.12,4.38 v15.31,4.38 | v11.88,41.88 12.37,42.37 IC1.54
  Bottom 0.305: v66.88,1.88 64.38,4.38 v53.12,4.38 | v15.31,4.38 15.31,23.44 11.88,26.88 v11.88,41.88
R1  (via drill 0.6)
  Top 0.406: IC3.1 78.44,30.38 78.44,40.62 76.7,42.36 R49.2 75.94,42.52 v75.94,44.69
  Bottom 0.406: v75.94,44.69 72.5,48.12 X1.P1.4
R2  (via drill 0.6)
  Top 0.305: IC3.3 72.81,27.3 72.81,31.56
  Top 0.406: 72.81,31.56 74.06,32.81 74.06,37.19 72.72,38.52 R42.2 72.81,39.77 72.81,43.12 71.25,44.69 v70,44.69
  Bottom 0.406: v70,44.69 69,45.69 X1.P1.5
S4/S1
  Top 0.406: X1.P1.2 79.5,70.76 C7.1 79.2,69 R19.2 R13.1
SIG_BRAKE
  Top 0.406: X1.P1.10 44.44,77.25 40,72.81 40,70.56 R4.1
SIG_FORWARD  (via drill 0.6)
  Top 0.305: v74.69,74.69 71.52,71.52 R6.1
  Bottom 0.305: X1.P1.11 81.25,79.5 81.25,76.25 79.69,74.69 v74.69,74.69
SIG_REVERSE
  Top 0.305: X1.P1.12 78.75,81.25 76.88,79.38 75.62,79.38 74.38,78.12 74.38,76.56 72.19,74.38 71.25,74.38 69.06,72.19 69.06,69.52 R7.1
SIG_START
  Top 0.406: X1.P1.9 55,77.19 52.81,75 47.19,75 44.38,72.19 44.38,70.58 R3.1
THROTTLE1
  Top 0.406: X1.P1.7 61.94,77.25 57.5,72.81 54.69,72.81 53.75,71.88 53.7,71.88 R23.1
THROTTLE2
  Top 0.406: X1.P1.8 58.5,76.94 55.31,73.75 50.94,73.75 49.06,71.88 49.01,71.88 R24.1
TIM1_CH2N  (via drill 0.6)
  Top 0.305: IC6.4 10,62.81 7.81,60.62 v7.81,52.81 | v20.62,44.69 21.56,44.69 22.73,45.85 IC1.35
  Bottom 0.305: v7.81,52.81 10,50.62 14.69,50.62 17.19,48.12 17.19,45.31 17.81,44.69 v20.62,44.69
VCC  (via drill 0.6)
  Top 0.305: R28.1 56.25,22.81 57.76,24.32 | 57.76,24.32 L1.2 | 57.76,24.32 56.22,25.87 IC2.3 | R13.2 76.79,64.77 v76.88,64.06 | R45.2 v20.94,65.31 | R43.2 v27.19,63.12 | IC4.8 17.47,53.72 v17.19,53.44 12.5,53.44 11.88,54.06 11.88,56.45 R50.2 | R21.2 66.25,70.81 v66.25,71.88
  Top 0.61: IC3.2 74.06,27.28 | v69.38,24.38 70,25 73.44,25 74.07,25.64 IC3.2 | IC3.2 74.06,28.75 73.63,29.18 C21.2 73.81,29.75 76.25,32.19 76.25,34.44 C23.+
  Top 0.813: L1.2 63.98,24.32 C20.1 64.23,24.36 C22.1 67.51,24.38 v69.38,24.38
  Bottom 0.305: v76.88,64.06 77.19,63.75 77.67,63.75 | v20.94,65.31 20.94,65 21.25,64.69 | v27.19,63.12 27.19,63.75 26.88,64.06 | v17.19,53.44 17.19,52.81 17.5,52.5 | v66.25,71.88 66.56,72.19
  Bottom 0.813: v69.38,24.38 69.69,24.69 69.69,25.31
  pour Bottom: 5.31,85.61 79.68,85.61 79.69,59.06 79.69,1.27 5.33,1.27 5.31,8.44 41.56,8.44 41.56,50.31 5.31,50.31
VCCIO  (via drill 0.6)
  Top 0.254: 8.66,20.9 6.2,20.9
  Top 0.305: R33.1 65.71,30.71 64.38,29.38 IC2.2 55.89,29.71 C27.1 | IC5.3 37.1,48.36 C41.1 v37.19,46.88 | IC1.48 14.05,46.81 C16.2 12.25,46.94 v12.19,46.88 | v26.25,48.12 26.12,47.99 C18.2 25.68,46.71 IC1.32 | C15.2 13.94,37.03 IC1.64 | C15.2 16.11,35.3 IC1.1 | R32.1 8.75,36.56 v10,35.31 v10.01,35.3 C15.2 | L3.1 34.92,31.54 L2.2 28.75,31.61 R53.2 | IC1.19 28.77,38.37 C17.2 28.85,38.44 v30.31,38.44 | J1.1 8.66,20.9 | 6.2,20.9 v5.62,21.25
  Top 0.406: C27.1 53.55,29.69 45.31,29.69 43.44,31.56 v39.38,31.56 39.38,33.12 38.12,34.38 36.25,34.38 35,33.12 35,33.19 L3.1
  Bottom 0.305: v37.19,46.88 35.62,46.88 | v12.19,46.88 11.56,46.88 | v10,35.31 10,35 | v30.31,38.44 30.31,37.81 | v5.62,21.25 5.62,21.88
  Bottom 0.406: v39.38,31.56 39.38,32.19
  pour Bottom: 40,9.69 40,49.06 5.31,49.06 5.31,9.69
VH  (via drill 0.6)
  Top 0.406: v27.19,69.06 30.39,69.06 R54.1
  Bottom 0.406: X1.P2.5 13.06,77.25 21.25,69.06 v27.19,69.06

### Text on the board
tPlace: Close SJ1/2 for encoder use
tNames: SJ3 CAN termination | openinverter.org Prius Gen 2 rev 1.4 | (C) 2026 Johannes Huebner
bStop: openinverter.org | (c) 2026 Johannes Huebner